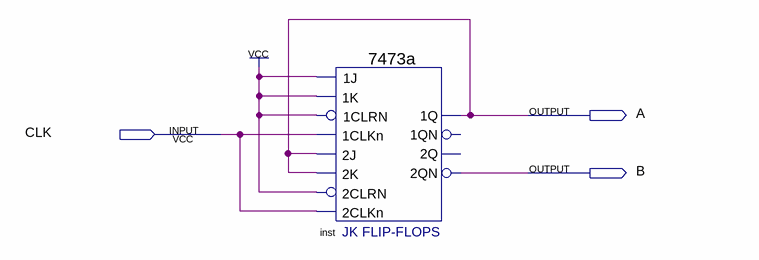
[diagram p0: schematic sheet]
// Quartus schematic CPLD_Mod4.bdf as structural Verilog: 1 symbols, 3 pins
module CPLD_Mod4 (
  input  CLK,
  output A,
  output B
);

  \7473a  inst (
    .\1CLRN (1'b1), .\1CLKn (CLK), .\2J (A), .\1K (1'b1), .\2CLKn (CLK), .\2CLRN (1'b1), .\2K (A),
    .\1J (1'b1), .\1Q (A), .\2QN (B));  // open: 2Q, 1QN
endmodule
